# EasyEDA schematic Camera_IR.json
TITLE: Counter_Water; REV: 1.0; Date: 2025-07-06; Sheet: 1/1; Company: Museum of Science
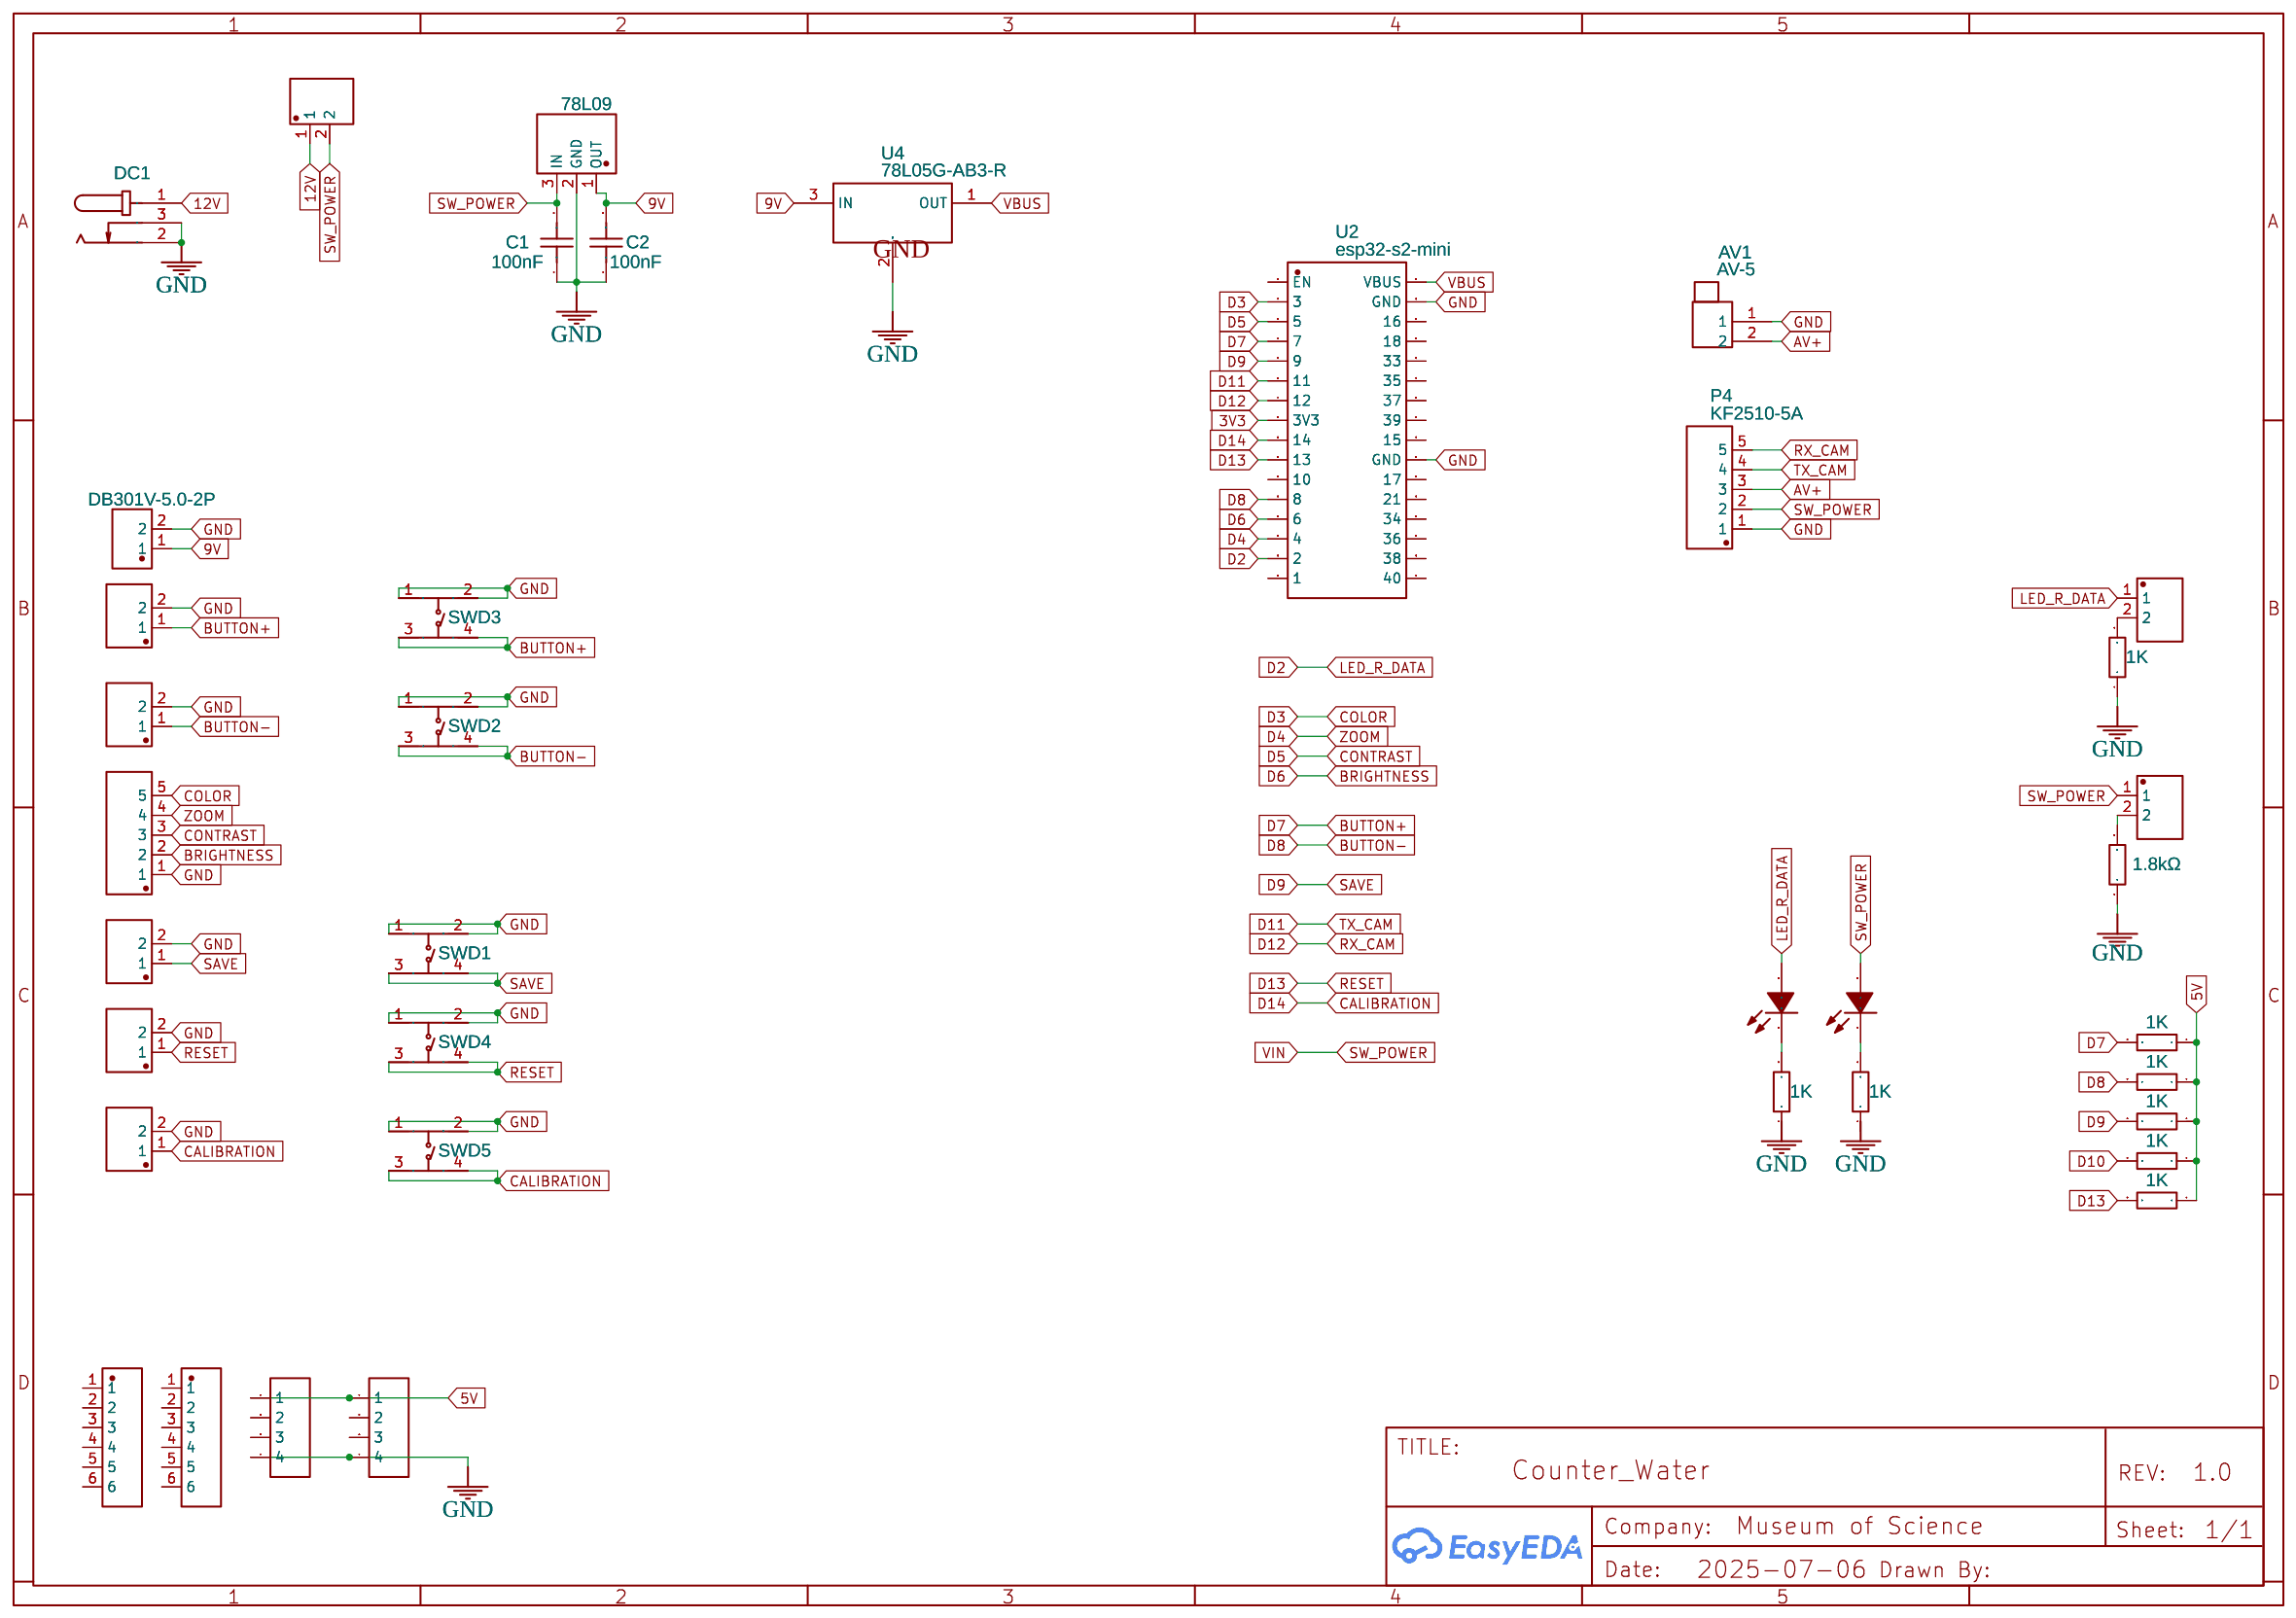
[diagram p0: schematic sheet]

## Parts
AV1  AV-5  [CONN-TH_AV-5]
C1  100nF  [C0603]
C2  100nF  [C0603]
D1  SAVE  [CONN-TH_KF2510-2A]
D2  SAVE  [CONN-TH_KF2510-2A]
D7  B+  [CONN-TH_KF2510-2A]
D8  B-  [CONN-TH_KF2510-2A]
D9  SAVE  [CONN-TH_KF2510-2A]
D13  RESET  [CONN-TH_KF2510-2A]
D14  FFC  [CONN-TH_KF2510-2A]
DC1  DC  [DC-IN-TH_DC005]
ERL1  1K  [R0603]
ERL2  1K  [R0603]
ERL4  1K  [R0603]
ERL5  1K  [R0603]
ERL6  1K  [R0603]
ERL9  1K  [R0603]
ERL11  1K  [R0603]
ERL12  1K  [R0603]
J6  HDR-M-2.54_1x4  [HDR-M-2.54_1X4]
J7  HDR-M-2.54_1x4  [HDR-M-2.54_1X4]
LED4  KT-0603R  [LED0603-RD]
LED5  KT-0603R  [LED0603-RD]
P1  KF2510-5A  [CONN-TH_5P-P2.54_KF2510-5A]
P2  H6  [HDR-TH_6P-P2.54-V-F]
P3  H6  [HDR-TH_6P-P2.54-V-F]
P4  KF2510-5A  [CONN-TH_5P-P2.54_KF2510-5A]
R5  1.8kΩ  [R0603]
SW_P  SW_P  [CONN-TH_KF2510-2A]
SWD1  TC-6610-7-160G  [SW-TH_4P-L5.0-W5.0-P4.50-LS6.5]
SWD2  TC-6610-7-160G  [SW-TH_4P-L5.0-W5.0-P4.50-LS6.5]
SWD3  TC-6610-7-160G  [SW-TH_4P-L5.0-W5.0-P4.50-LS6.5]
SWD4  TC-6610-7-160G  [SW-TH_4P-L5.0-W5.0-P4.50-LS6.5]
SWD5  TC-6610-7-160G  [SW-TH_4P-L5.0-W5.0-P4.50-LS6.5]
U1  78L09  [SOT-89-3_L4.5-W2.5-P1.50-LS4.0-BR]
U2  esp32-s2-mini  [NEW_FOOTPRINT]
U3  DB301V-5.0-2P  [CONN-TH_2P-P5.00_L7.6-W10.0]
U4  78L05G-AB3-R  [SOT-89-3_L4.5-W2.5-P1.50-LS4.2-BR]

## Library data of the parts
AV1 = AV-5: Supplier: LCSC; Manufacturer: BOOMELE(博穆精密); Supplier Part: C18080; JLCPCB Part Class: Extended Part
C1 C2 = CC0603KRX7R9BB104: Supplier: LCSC; Manufacturer: YAGEO(国巨); Supplier Part: C14663; JLCPCB Part Class: Basic Part
D1 D2 D7-D9 D13 D14 SW_P = KF2510-2A: Supplier: LCSC; Manufacturer: BOOMELE; Supplier Part: C27543; JLCPCB Part Class: Extended Part; Package Display: No
DC1 = DC005-2.0MM: Supplier: LCSC; Manufacturer: SOFNG; Supplier Part: C111567; Package Display: No
ERL1 ERL2 ERL4-ERL6 ERL9 ERL11 ERL12 = 0603WAF1001T5E: Supplier: LCSC; Manufacturer: UniOhm; Supplier Part: C21190; JLCPCB Part Class: Basic Part; Package Display: No
J6 J7 = HDR-M-2.54_1x4: Supplier Part: C124378; Supplier: LCSC; Contributor: LCEDA_Lib; Package Display: No
LED4 LED5 = KT-0603R: Supplier: LCSC; Manufacturer: KENTO; Supplier Part: C2286; JLCPCB Part Class: Basic Part
P1 P4 = KF2510-5A: Supplier: LCSC; Manufacturer: BOOMELE(博穆精密); Manufacturer Part: 2510-5A; Supplier Part: C27544; JLCPCB Part Class: Extended Part
P2 P3 = Header-Female-2.54_1x6: Supplier: LCSC; Manufacturer: BOOMELE(博穆精密); Manufacturer Part: 2.54-1*6P母; Supplier Part: C40877; JLCPCB Part Class: Extended Part
R5 = 0603WAF1801T5E: Supplier: LCSC; Manufacturer: UNI-ROYAL(厚声); Supplier Part: C4177; JLCPCB Part Class: Basic Part
SWD1-SWD5 = TC-6610-7-160G: Contributor: LCSC; Supplier: LCSC; Supplier Part: C2845252; Manufacturer: HCTL(华灿天禄); JLCPCB Part Class: Extended Part; Package Display: No
U1 = 78L09U 78L09: Contributor: LCSC; Supplier: LCSC; Supplier Part: C2875177; Manufacturer: CBI(创基); JLCPCB Part Class: Extended Part; Package Display: No
U2 = esp32-s2-mini: Contributor: nath8505
U3 = DB301V-5.0-2P: Contributor: LCSC; Supplier: LCSC; Supplier Part: C395882; Manufacturer: DORABO(地博电气); Manufacturer Part: DB301V-5.0-2P-BU-S; JLCPCB Part Class: Extended Part
U4 = 78L05G-AB3-R: Supplier: LCSC; Manufacturer: UTC(友顺); Supplier Part: C71136; JLCPCB Part Class: Basic Part

## Nets
3V3: U2.8(3V3)
5V: ERL2.1 ERL6.1 ERL9.1 ERL11.1 ERL12.1 J6.1 J7.1
9V: C2.2 U1.1(OUT) U3.1 U4.3(IN)
12V: DC1.1 SW_P.1
GND: AV1.1 C1.1 C2.1 D7.2 D8.2 D9.2 D13.2 D14.2 DC1.2 DC1.3 ERL1.1 ERL4.1 ERL5.1 J6.4 J7.4 P1.1 P4.1 R5.1 SWD1.1 SWD1.2 SWD2.1 SWD2.2 SWD3.1 SWD3.2 SWD4.1 SWD4.2 SWD5.1 SWD5.2 U1.2(GND) U2.23(GND) U2.31(GND) U3.2 U4.2(GND)
VBUS: U2.32(VBUS) U4.1(OUT)
AV+: AV1.2 P4.3
BRIGHTNESS: P1.2 U2.13(6)
BUTTON+: D7.1 ERL6.2 SWD3.3 SWD3.4 U2.4(7)
BUTTON-: D8.1 ERL11.2 SWD2.3 SWD2.4 U2.12(8)
CALIBRATION: D14.1 SWD5.3 SWD5.4 U2.9(14)
COLOR: P1.5 U2.2(3)
CONTRAST: P1.3 U2.3(5)
D2: D2.1 LED5.2(A) U2.15(2)
D4: P1.4 U2.14(4)
D9: D9.1 ERL9.2 SWD1.3 SWD1.4 U2.5(9)
D10: ERL12.2
D11: P4.4 U2.6(11)
D12: P4.5 U2.7(12)
D13: D13.1 ERL2.2 SWD4.3 SWD4.4 U2.10(13)
SW_POWER: C1.2 D1.1 LED4.2(A) P4.2 SW_P.2 U1.3(IN)
Net-(D1-2): D1.2 R5.2
Net-(D2-2): D2.2 ERL5.2
Net-(ERL1-2): ERL1.2 LED5.1(K)
Net-(ERL4-2): ERL4.2 LED4.1(K)

Not connected (* = marked no-connect by the designer): J6 2 3; J7 2 3; P2 1 2 3 4 5 6; P3 1 2 3 4 5 6; U2 1(EN) 11(10) 16(1) 17(40) 18(38) 19(36) 20(34) 21 22(17) 24(15) 25(39) 26(37) 27(35) 28(33) 29(18) 30(16)
